# Altium schematic sheet USB2UART.SchDoc
size A4
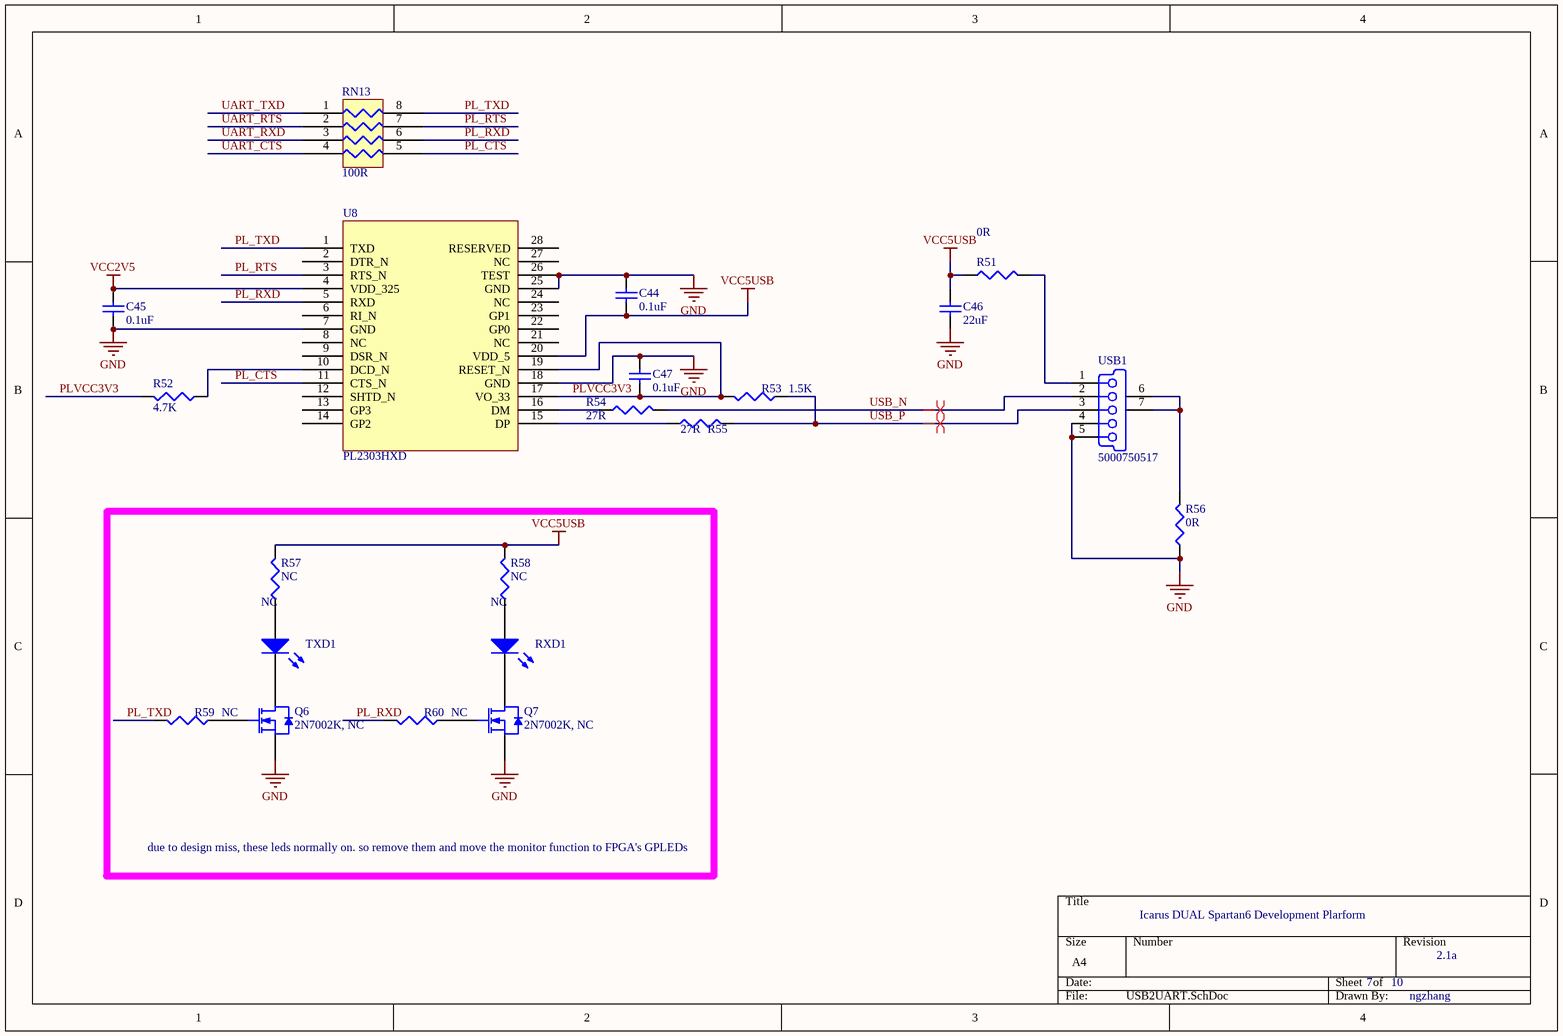
[diagram p0: USB2UART.SchDoc]

## Parts
C44  0.1uF  [1608[0603]]
C45  0.1uF  [1608[0603]]
C46  22uF  [C1206]
C47  0.1uF  [1608[0603]]
Q6  2N7002K, NC  [SOT23_N]
Q7  2N7002K, NC  [SOT23_N]
R51  0R  [J1-0603]
R52  4.7K  [J1-0603]
R53  1.5K  [J1-0603]
R54  27R  [J1-0603]
R55  27R  [J1-0603]
R56  0R  [J1-0603]
R57  NC  [J1-0603]
R58  NC  [J1-0603]
R59  NC  [J1-0603]
R60  NC  [J1-0603]
RN13  100R  [EXBV8V]
RXD1  NC  [CD1608-0603]
TXD1  NC  [CD1608-0603]
U8  PL2303HXD  [SSOP28_N]
USB1  5000750517  [5000750517]

## Nets
GND: C44.2 C45.1 C46.1 C47.2 Q6.2(S) Q7.2(S) R56.1 U8.7(GND) U8.18(GND) U8.25(GND) U8.26(TEST) USB1.4(ID) USB1.5(GND)
VCC2V5: C45.2 U8.4(VDD_325)
VCC5USB: C44.1 C46.2 R51.1 R57.2 R58.2 U8.20(VDD_5)
PL_CTS: RN13.5 U8.11(CTS_N)
PL_RTS: RN13.7 U8.3(RTS_N)
PL_RXD: R60.2 RN13.6 U8.5(RXD)
PL_TXD: R59.2 RN13.8 U8.1(TXD)
PLVCC3V3: C47.1 R52.2 R53.2 U8.17(VO_33) U8.19(RESET_N)
UART_CTS: RN13.4
UART_RTS: RN13.2
UART_RXD: RN13.3
UART_TXD: RN13.1
USB_N: R54.2 USB1.2(D-)
USB_P: R53.1 R55.2 USB1.3(D+)
NetQ6_1: Q6.1(G) R59.1
NetQ6_3: Q6.3(D) TXD1.2(K)
NetQ7_1: Q7.1(G) R60.1
NetQ7_3: Q7.3(D) RXD1.2(K)
NetR51_2: R51.2 USB1.1(V_BUS)
NetR52_1: R52.1 U8.10(DCD_N)
NetR54_1: R54.1 U8.16(DM)
NetR55_1: R55.1 U8.15(DP)
NetR56_2: R56.2 USB1.6(MH1) USB1.7(MH2)
NetR57_1: R57.1 TXD1.1(A)
NetR58_1: R58.1 RXD1.1(A)

Not connected (* = marked no-connect by the designer): U8 2(DTR_N) 6(RI_N) 8(NC) 9(DSR_N) 12(SHTD_N) 13(GP3) 14(GP2) 21(NC) 22(GP0) 23(GP1) 24(NC) 27(NC) 28(RESERVED)

## Layout directives
differential pair: USB_N, USB_P

## Notes on the sheet
- due to design miss, these leds normally on. so remove them and move the monitor function to FPGA's GPLEDs
- Icarus DUAL Spartan6 Development Plarform
- 7
- 10
- 2.1a
- ngzhang

## Library data of the parts
C44-C47 = Cap Semi: Capacitor (Semiconductor SIM Model); Published: 8-Jun-2000; LatestRevisionDate: 29-May-2009; LatestRevisionNote: IPC-7351 Footprint Added.; PackageReference: C1206; Publisher: Altium Limited; PackageDescription: Chip Capacitor
  C44 C45 C47: Value: 0.1uF
  C46: Value: 22uF
Q6 Q7 = 2N7002: N-channel Enhancement Mode Field-effect Transistor; Published: 17-Sep-2003; LatestRevisionDate: 12-Dec-2006; LatestRevisionNote: IPC-7351 Footprint Added.; DatasheetVersion: 27-Jul-2000; PackageVersion: May-1999; PackageReference: SOT23; Publisher: Altium Limited; PackageDescription: 3-Pin SOT-23 Package 0.95 mm Pitch, 2.3 mm Lead Span; ComponentLink1Description: Manufacturer Link; ComponentLink1URL: http://www.semiconductors.philips.com/; ComponentLink2Description: Datasheet; ComponentLink2URL: http://www.semiconductors.philips.com/acrobat/datasheets/2N7002_4.pdf
R51-R60 = Res3: Resistor; Published: 8-Jun-2000; LatestRevisionDate: 29-May-2009; LatestRevisionNote: IPC-7351 Footprint Added.; PackageReference: J1-0603; Publisher: Altium Limited; PackageDescription: Chip Resistor
  R51 R56: Value: 0R
  R52: Value: 4.7K
  R53: Value: 1.5K
  R54 R55: Value: 27R
  R57-R60: Value: NC
RN13 = RES4PACK
RXD1 TXD1 = LED3: Typical BLUE SiC LED; Published: 8-Jun-2000; LatestRevisionDate: 17-Dec-2003; LatestRevisionNote: PCB Footprint replaced.; DatasheetVersion: 16-Apr-2002; PackageVersion: 16-Apr-2002; PackageReference: 3.5X2.8X1.9; Publisher: Altium Limited; PackageDescription: SM LED; 2 C-Bend Leads; Body 3.5 x 2.8 x 1.9 mm, inc leads (LxWxH typ)
U8 = PL2303
USB1 = 5000750517: USB On-The-Go (OTG) Mini-B Receptacle, Right Angle, Thru-Hole, 0.80mm (.031") Pitch, Solder Tails & Shell Tabs with Dimples; PCB_Layout: Complies with Manufacturer's Recommendation.; Published: 30-May-2008; DatasheetVersion: rev0, Mar-2004; PackageVersion: rev0, Mar-2004; PackageReference: 5000750517; Publisher: Altium Limited; PackageDescription: USB Mini-B, Type 2, Thru-Hole; 5 Position; Vertical, Body 7.7 x 4.2 x 7.7 mm (LxWxH); ComponentLink1Description: Manufacturer Link; ComponentLink1URL: http://www.molex.com/; ComponentLink2Description: Datasheet; ComponentLink2URL: http://www.molex.com/pdm_docs/sd/5000750517_sd.pdf